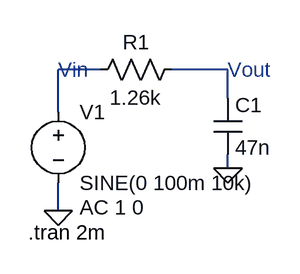
[diagram p0: schematic lowpass.asc]
lowpass.asc, the LTspice schematic file:
Version 4
SHEET 1 880 680
WIRE 176 80 128 80
WIRE 320 80 256 80
WIRE 320 112 320 80
WIRE 128 128 128 80
WIRE 320 192 320 176
WIRE 128 240 128 208
FLAG 128 240 0
FLAG 320 192 0
SYMBOL res 272 64 R90
WINDOW 0 0 56 VBottom 2
WINDOW 3 32 56 VTop 2
SYMATTR InstName R1
SYMATTR Value 1.26k
SYMBOL cap 304 112 R0
SYMATTR InstName C1
SYMATTR Value 47n
SYMBOL voltage 128 112 R0
WINDOW 123 24 124 Left 2
WINDOW 39 0 0 Left 0
SYMATTR InstName V1
SYMATTR Value SINE(0 100m 10k)
SYMATTR Value2 AC 1 0
TEXT 94 264 Left 2 !.tran 2m
TEXT 128 80 Left 2 ;Vin
TEXT 320 80 Left 2 ;Vout

The netlist it stands for:
* lowpass.asc
R1 N002 N001 1.26k
C1 N002 0 47n
V1 N001 0 SINE(0 100m 10k) AC 1 0
.tran 2m
* Vin
* Vout
.backanno
.end